# Altium project PCB_Project.PrjPCB
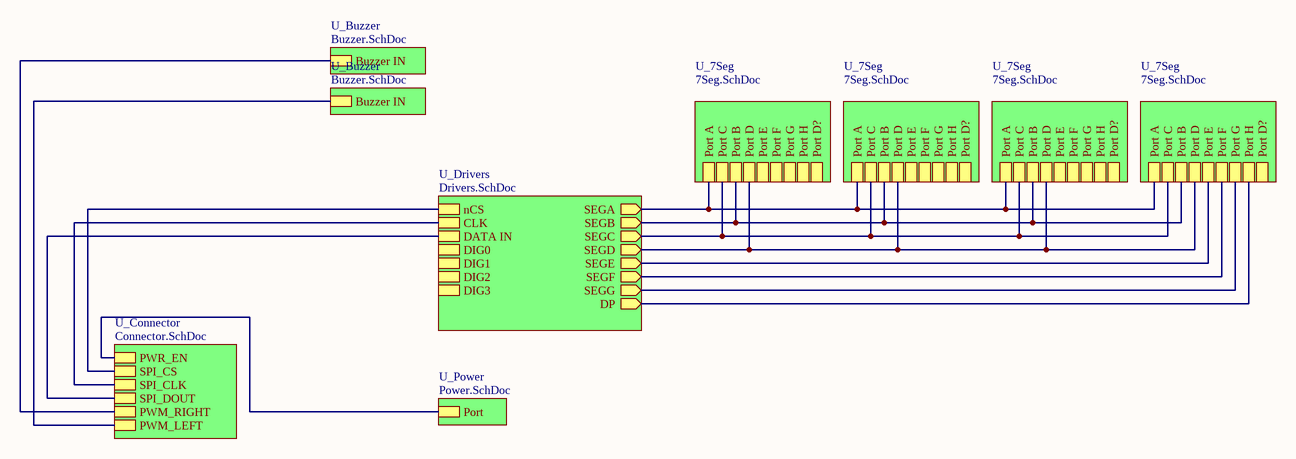
[diagram p0: Main.SchDoc]
6 sheets, 33 parts. Net scope: hierarchical (ports join the sheet entries above them; power ports are global).
Sheets:
  Main.SchDoc
    U_Buzzer = Buzzer.SchDoc
    U_7Seg = 7Seg.SchDoc
    U_7Seg = 7Seg.SchDoc
    U_7Seg = 7Seg.SchDoc
    U_7Seg = 7Seg.SchDoc
    U_Connector = Connector.SchDoc
    U_Drivers = Drivers.SchDoc
    U_Buzzer = Buzzer.SchDoc
    U_Power = Power.SchDoc

## Sheet Main.SchDoc
size A4

### Sub-sheets
U_7Seg = 7Seg.SchDoc: Port A, Port C, Port B, Port D, Port E, Port F, Port G, Port H, Port D?
U_7Seg = 7Seg.SchDoc: Port A, Port C, Port B, Port D, Port E, Port F, Port G, Port H, Port D?
U_7Seg = 7Seg.SchDoc: Port A, Port C, Port B, Port D, Port E, Port F, Port G, Port H, Port D?
U_7Seg = 7Seg.SchDoc: Port A, Port C, Port B, Port D, Port E, Port F, Port G, Port H, Port D?
U_Buzzer = Buzzer.SchDoc: Buzzer IN
U_Buzzer = Buzzer.SchDoc: Buzzer IN
U_Connector = Connector.SchDoc: PWR_EN, SPI_CS, SPI_CLK, SPI_DOUT, PWM_RIGHT, PWM_LEFT
U_Drivers = Drivers.SchDoc: nCS, CLK, DATA IN, SEGA (out), DIG0, DIG1, DIG2, DIG3, SEGB (out), SEGC (out), SEGD (out), SEGE (out), SEGF (out), SEGG (out), DP (out)
U_Power = Power.SchDoc: Port

### Nets
NetIC?#2_1: sheet U_Connector/SPI_DOUT, sheet U_Drivers/DATA IN
NetIC?#2_12: sheet U_Connector/SPI_CS, sheet U_Drivers/nCS
NetIC?#2_13: sheet U_Connector/SPI_CLK, sheet U_Drivers/CLK
NetIC?#3_14: sheet U_7Seg/Port A, sheet U_7Seg/Port A, sheet U_7Seg/Port A, sheet U_7Seg/Port A, sheet U_Drivers/SEGA
NetIC?#3_15: sheet U_7Seg/Port B, sheet U_7Seg/Port B, sheet U_7Seg/Port B, sheet U_7Seg/Port B, sheet U_Drivers/SEGB
NetIC?#3_16: sheet U_7Seg/Port C, sheet U_7Seg/Port C, sheet U_7Seg/Port C, sheet U_7Seg/Port C, sheet U_Drivers/SEGC
NetIC?#3_17: sheet U_7Seg/Port D, sheet U_7Seg/Port D, sheet U_7Seg/Port D, sheet U_7Seg/Port D, sheet U_Drivers/SEGD
NetIC?#3_20: sheet U_7Seg/Port E, sheet U_Drivers/SEGE
NetIC?#3_21: sheet U_7Seg/Port F, sheet U_Drivers/SEGF
NetIC?#3_22: sheet U_7Seg/Port G, sheet U_Drivers/SEGG
NetIC?#3_23: sheet U_7Seg/Port H, sheet U_Drivers/DP
NetIC?#4_4: sheet U_Connector/PWR_EN, sheet U_Power/Port
NetM?_U_Buzzer#1_G: sheet U_Buzzer/Buzzer IN, sheet U_Connector/PWM_RIGHT
NetM?_U_Buzzer#2_G: sheet U_Connector/PWM_LEFT, sheet U_Buzzer/Buzzer IN

## Sheet Buzzer.SchDoc
size A4
Used 2 times, as channels U_Buzzer, U_Buzzer. Parts and nets are listed once, with the designators drawn on the sheet.
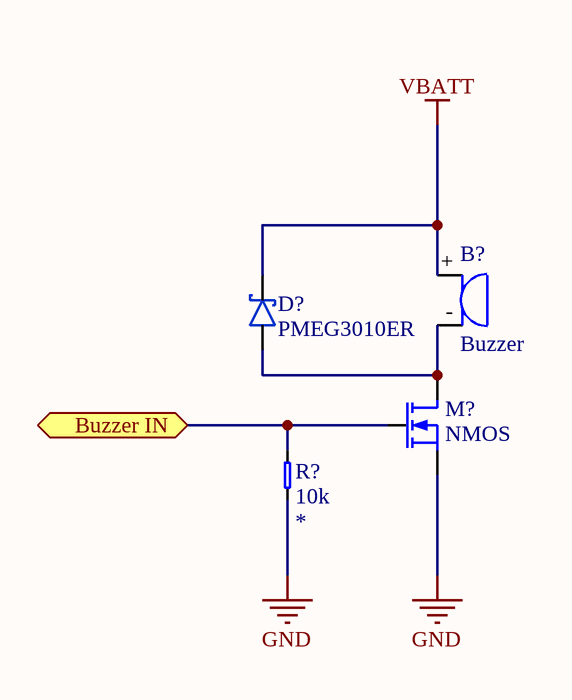
[diagram p1: Buzzer.SchDoc]

### Parts
B?  Buzzer  [SD160709]
D?  PMEG3010ER  [SOD123W]
M?  NMOS  [MOSFET-SOT23]
R?  value 10k  [0603_RES_LD]  (hidden comment: Resistor)

### Ports
Buzzer IN

### Nets
GND: M?.S R?.2
VBATT: B?.+ D?.K
Buzzer IN: M?.G R?.1 ; port Buzzer IN
NetB?_-: B?.- D?.A M?.D

### Channels
U_Buzzer: designators end in _U_Buzzer#1; ports Buzzer IN=NetM?_U_Buzzer#1_G
U_Buzzer: designators end in _U_Buzzer#2; ports Buzzer IN=NetM?_U_Buzzer#2_G

### Library data of the parts
B? = SD160709: TDK SD160709 Buzzer; Reference: SD160709
D? = Schottky_PMEG3010ER: Nexperia 1A low Vf Mega Schottky barrier rectifier; Reference: PMEG3010ER
M? = N-MOSFET: N MOSFET
R? = Resistor: Precision: *; Package: *

## Sheet 7Seg.SchDoc
size A4
Used 4 times, as channels U_7Seg, U_7Seg, U_7Seg, U_7Seg. Parts and nets are listed once, with the designators drawn on the sheet.
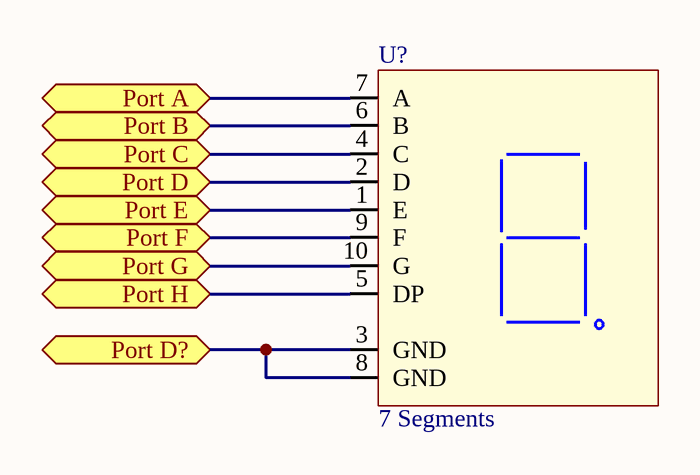
[diagram p2: 7Seg.SchDoc]

### Parts
U?  7 Segments  [SA10-21GWA]

### Ports
Port A, Port B, Port C, Port D, Port D?, Port E, Port F, Port G, Port H

### Nets
Port A: U?.7(A) ; port Port A
Port B: U?.6(B) ; port Port B
Port C: U?.4(C) ; port Port C
Port D: U?.2(D) ; port Port D
Port D?: U?.3(GND) U?.8(GND) ; port Port D?
Port E: U?.1(E) ; port Port E
Port F: U?.9(F) ; port Port F
Port G: U?.10(G) ; port Port G
Port H: U?.5(DP) ; port Port H

### Channels
U_7Seg: designators end in _U_7Seg#1; ports Port A=NetIC?#3_14 Port B=NetIC?#3_15 Port C=NetIC?#3_16 Port D=NetIC?#3_17 Port D?=NetU?_U_7Seg#1_3 Port E=NetU?_U_7Seg#1_1 Port F=NetU?_U_7Seg#1_9 Port G=NetU?_U_7Seg#1_10 Port H=NetU?_U_7Seg#1_5
U_7Seg: designators end in _U_7Seg#2; ports Port A=NetIC?#3_14 Port B=NetIC?#3_15 Port C=NetIC?#3_16 Port D=NetIC?#3_17 Port D?=NetU?_U_7Seg#2_3 Port E=NetU?_U_7Seg#2_1 Port F=NetU?_U_7Seg#2_9 Port G=NetU?_U_7Seg#2_10 Port H=NetU?_U_7Seg#2_5
U_7Seg: designators end in _U_7Seg#3; ports Port A=NetIC?#3_14 Port B=NetIC?#3_15 Port C=NetIC?#3_16 Port D=NetIC?#3_17 Port D?=NetU?_U_7Seg#3_3 Port E=NetIC?#3_20 Port F=NetIC?#3_21 Port G=NetIC?#3_22 Port H=NetIC?#3_23
U_7Seg: designators end in _U_7Seg#4; ports Port A=NetIC?#3_14 Port B=NetIC?#3_15 Port C=NetIC?#3_16 Port D=NetIC?#3_17 Port D?=NetU?_U_7Seg#4_3 Port E=NetU?_U_7Seg#4_1 Port F=NetU?_U_7Seg#4_9 Port G=NetU?_U_7Seg#4_10 Port H=NetU?_U_7Seg#4_5

### Library data of the parts
U? = SC10-21SRWA: KingBright Led 7 Segments; Reference: SC10-21SRWA

## Sheet Connector.SchDoc
size A4
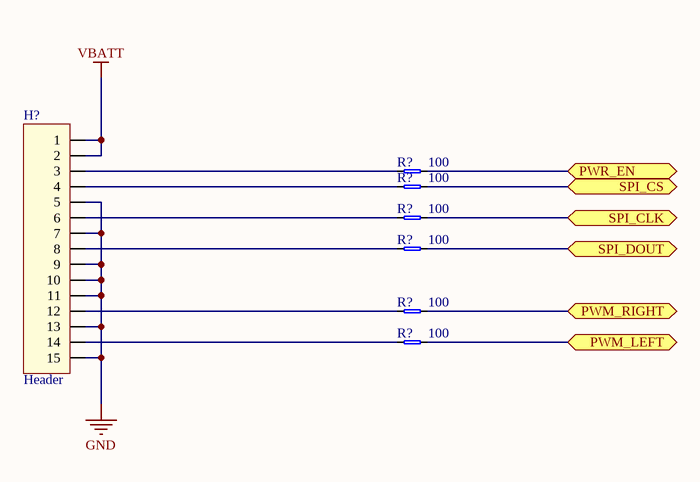
[diagram p3: Connector.SchDoc]

### Parts
(Parts that share a designator on the sheet are numbered #1, #2 ... from top to bottom, then left to right.)
H?  Header  [653115131822]
R?#1  value 100  [0402_RES_LD]  (hidden comment: Resistor)
R?#2  value 100  [0402_RES_LD]  (hidden comment: Resistor)
R?#3  value 100  [0402_RES_LD]  (hidden comment: Resistor)
R?#4  value 100  [0402_RES_LD]  (hidden comment: Resistor)
R?#5  value 100  [0402_RES_LD]  (hidden comment: Resistor)
R?#6  value 100  [0402_RES_LD]  (hidden comment: Resistor)

### Ports
PWM_LEFT, PWM_RIGHT, PWR_EN, SPI_CLK, SPI_CS, SPI_DOUT

### Nets
GND: H?.5 H?.7 H?.9 H?.10 H?.11 H?.13 H?.15
VBATT: H?.1 H?.2
NetH?_3: H?.3 R?#1.1
NetH?_4: H?.4 R?#2.1
NetH?_6: H?.6 R?#3.1
NetH?_8: H?.8 R?#4.1
NetH?_12: H?.12 R?#5.1
NetH?_14: H?.14 R?#6.1
NetIC?#2_1: R?#4.2 ; port SPI_DOUT
NetIC?#2_12: R?#2.2 ; port SPI_CS
NetIC?#2_13: R?#3.2 ; port SPI_CLK
NetIC?#4_4: R?#1.2 ; port PWR_EN
NetM?_U_Buzzer#1_G: R?#5.2 ; port PWM_RIGHT
NetM?_U_Buzzer#2_G: R?#6.2 ; port PWM_LEFT

### Library data of the parts
H? = HEADER_15x1: Header 15x1
R?#1-R?#6 = Resistor: Precision: *

## Sheet Drivers.SchDoc
size A4
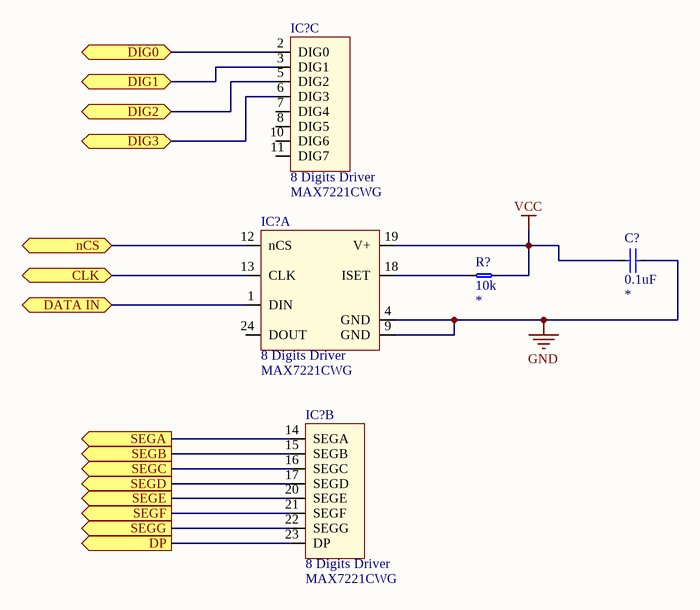
[diagram p4: Drivers.SchDoc]

### Parts
(Parts that share a designator on the sheet are numbered #1, #2 ... from top to bottom, then left to right.)
C?#1  value 0.1uF  [0402_CAP_LD]  (hidden comment: CerCap)
IC?#1  8 Digits Driver  [MAX7221CWG]  (part C of 3)
IC?#2  8 Digits Driver  [MAX7221CWG]  (part A of 3)
IC?#3  8 Digits Driver  [MAX7221CWG]  (part B of 3)
R?#7  value 10k  [0603_RES_LD]  (hidden comment: Resistor)

### Ports
CLK, DATA IN, DIG0, DIG1, DIG2, DIG3, DP (out), nCS, SEGA (out), SEGB (out), SEGC (out), SEGD (out), SEGE (out), SEGF (out), SEGG (out)

### Nets
GND: C?#1.2 IC?#2.4(GND) IC?#2.9(GND)
VCC: C?#1.1 IC?#2.19(V+) R?#7.2
NetIC?#1_2: IC?#1.2(DIG0) ; port DIG0
NetIC?#1_3: IC?#1.3(DIG1) ; port DIG1
NetIC?#1_5: IC?#1.5(DIG2) ; port DIG2
NetIC?#1_6: IC?#1.6(DIG3) ; port DIG3
NetIC?#2_1: IC?#2.1(DIN) ; port DATA IN
NetIC?#2_12: IC?#2.12(nCS) ; port nCS
NetIC?#2_13: IC?#2.13(CLK) ; port CLK
NetIC?#2_18: IC?#2.18(ISET) R?#7.1
NetIC?#3_14: IC?#3.14(SEGA) ; port SEGA
NetIC?#3_15: IC?#3.15(SEGB) ; port SEGB
NetIC?#3_16: IC?#3.16(SEGC) ; port SEGC
NetIC?#3_17: IC?#3.17(SEGD) ; port SEGD
NetIC?#3_20: IC?#3.20(SEGE) ; port SEGE
NetIC?#3_21: IC?#3.21(SEGF) ; port SEGF
NetIC?#3_22: IC?#3.22(SEGG) ; port SEGG
NetIC?#3_23: IC?#3.23(DP) ; port DP

Not connected (* = marked no-connect by the designer): IC?#1 7(DIG4) 8(DIG5) 10(DIG6) 11(DIG7); IC?#2 24(DOUT)

### Library data of the parts
C?#1 = CerCap: Ceramic Capacitor; Type: *; Voltage/Power: *; Package: *
IC?#1-IC?#3 = MAX7221: MAX7221 8 Digit 7 Segments Display; Reference: MAX7221CWG
R?#7 = Resistor: Precision: *; Package: *

## Sheet Power.SchDoc
size A4
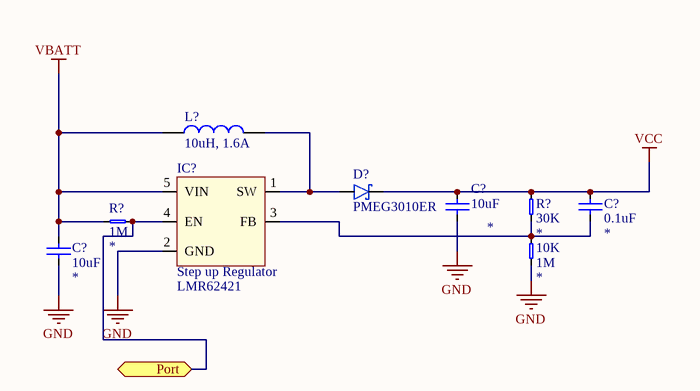
[diagram p5: Power.SchDoc]

### Parts
(Parts that share a designator on the sheet are numbered #1, #2 ... from top to bottom, then left to right.)
10K  value 1M  [0603_RES_LD]  (hidden comment: Resistor)
C?#2  value 10uF  [0805_CAP_LD]  (hidden comment: CerCap)
C?#3  value 0.1uF  [0402_CAP_LD]  (hidden comment: CerCap)
C?#4  value 10uF  [0805_CAP_LD]  (hidden comment: CerCap)
D?  PMEG3010ER  [SOD123W]
IC?#4  Step up Regulator  [LMR62421]
L?  10uH, 1.6A  [INDUCTOR_WE-LQS_5020]
R?#8  value 1M  [0603_RES_LD]  (hidden comment: Resistor)
R?#9  value 30K  [0603_RES_LD]  (hidden comment: Resistor)

### Ports
Port

### Nets
GND: 10K.1 C?#2.1 C?#4.1 IC?#4.2(GND)
VBATT: C?#4.2 IC?#4.5(VIN) L?.1 R?#8.1
VCC: C?#2.2 C?#3.2 D?.K R?#9.2
Net10K_2: 10K.2 C?#3.1 IC?#4.3(FB) R?#9.1
NetD?_A: D?.A IC?#4.1(SW) L?.2
NetIC?#4_4: IC?#4.4(EN) R?#8.2 ; port Port

### Library data of the parts
C?#2-C?#4 = CerCap: Ceramic Capacitor; Type: *; Voltage/Power: *; Package: *
D? = Schottky_PMEG3010ER: as D? on sheet Buzzer; Reference: PMEG3010ER
IC?#4 = LMR62421XMF: LMR62421 simple switcher 24 Vout stepup voltage SOT-23; Reference: LMR62421
L? = INDUCTOR_74404052100: WE-LQS SMD Power Inductor, size 5020, 10uH, 1.6A; DC Resistance: 109mOhm; Inductance Tolerance: +/-20%; Saturation Current: 1.95A; Self Resonant Frequency: 37MHz; ComponentLink1Description: Manufacturer; ComponentLink1URL: http://www.we-online.de; ComponentLink2Description: Datasheet; ComponentLink2URL: https://katalog.we-online.com/pbs/datasheet/74404052100.pdf; Part Number: 74404052100; Published Date: May 2019; Publisher: Wurth Elektronik; Rated Current: 1.6A; Inductance: 10uH; Operating Temperature: -40 to +125degC; Mounting Technology: SMT; Packaging: Tape and Reel; DC Resistance Tolerance: +/-20%; Size: 5020; Reference: 74404052100
10K R?#8 R?#9 = Resistor: Precision: *; Package: *

## Nets that join several sheets
GND: U_Buzzer (M?_U_Buzzer#1.S R?_U_Buzzer#1.2), Connector (7 pins), Drivers (C?#1.2 IC?#2.4 IC?#2.9), U_Buzzer (M?_U_Buzzer#2.S R?_U_Buzzer#2.2), Power (10K.1 C?#2.1 C?#4.1 IC?#4.2)
VBATT: U_Buzzer (B?_U_Buzzer#1.+ D?_U_Buzzer#1.K), Connector (H?.1 H?.2), U_Buzzer (B?_U_Buzzer#2.+ D?_U_Buzzer#2.K), Power (C?#4.2 IC?#4.5 L?.1 R?#8.1)
VCC: Drivers (C?#1.1 IC?#2.19 R?#7.2), Power (C?#2.2 C?#3.2 D?.K R?#9.2)
NetIC?#2_1: Connector (R?#4.2), Drivers (IC?#2.1)
NetIC?#2_12: Connector (R?#2.2), Drivers (IC?#2.12)
NetIC?#2_13: Connector (R?#3.2), Drivers (IC?#2.13)
NetIC?#3_14: U_7Seg (U?_U_7Seg#1.7), U_7Seg (U?_U_7Seg#2.7), U_7Seg (U?_U_7Seg#3.7), U_7Seg (U?_U_7Seg#4.7), Drivers (IC?#3.14)
NetIC?#3_15: U_7Seg (U?_U_7Seg#1.6), U_7Seg (U?_U_7Seg#2.6), U_7Seg (U?_U_7Seg#3.6), U_7Seg (U?_U_7Seg#4.6), Drivers (IC?#3.15)
NetIC?#3_16: U_7Seg (U?_U_7Seg#1.4), U_7Seg (U?_U_7Seg#2.4), U_7Seg (U?_U_7Seg#3.4), U_7Seg (U?_U_7Seg#4.4), Drivers (IC?#3.16)
NetIC?#3_17: U_7Seg (U?_U_7Seg#1.2), U_7Seg (U?_U_7Seg#2.2), U_7Seg (U?_U_7Seg#3.2), U_7Seg (U?_U_7Seg#4.2), Drivers (IC?#3.17)
NetIC?#3_20: U_7Seg (U?_U_7Seg#3.1), Drivers (IC?#3.20)
NetIC?#3_21: U_7Seg (U?_U_7Seg#3.9), Drivers (IC?#3.21)
NetIC?#3_22: U_7Seg (U?_U_7Seg#3.10), Drivers (IC?#3.22)
NetIC?#3_23: U_7Seg (U?_U_7Seg#3.5), Drivers (IC?#3.23)
NetIC?#4_4: Connector (R?#1.2), Power (IC?#4.4 R?#8.2)
NetM?_U_Buzzer#1_G: U_Buzzer (M?_U_Buzzer#1.G R?_U_Buzzer#1.1), Connector (R?#5.2)
NetM?_U_Buzzer#2_G: Connector (R?#6.2), U_Buzzer (M?_U_Buzzer#2.G R?_U_Buzzer#2.1)